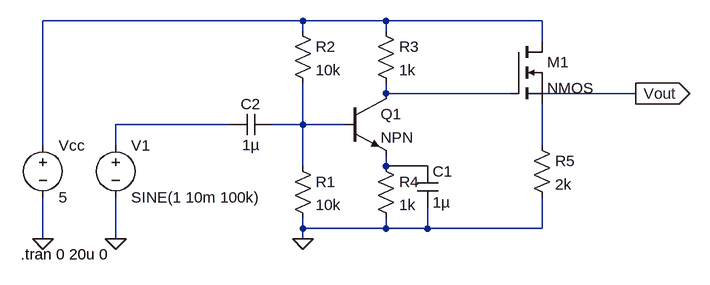
[diagram p0: schematic emissor_comum_bjt_coletor_comum_mos.asc]
emissor_comum_bjt_coletor_comum_mos.asc, the LTspice schematic file:
Version 4
SHEET 1 880 680
WIRE 96 -64 -304 -64
WIRE 224 -64 96 -64
WIRE 464 -64 224 -64
WIRE 96 -48 96 -64
WIRE 224 -48 224 -64
WIRE 464 -32 464 -64
WIRE 224 48 224 32
WIRE 416 48 224 48
WIRE 608 48 464 48
WIRE -16 96 -192 96
WIRE 96 96 96 32
WIRE 96 96 48 96
WIRE 160 96 96 96
WIRE -304 128 -304 -64
WIRE -192 128 -192 96
WIRE 464 128 464 64
WIRE 96 160 96 96
WIRE 224 160 224 144
WIRE 288 160 224 160
WIRE 96 256 96 240
WIRE 224 256 224 240
WIRE 224 256 96 256
WIRE 288 256 288 224
WIRE 288 256 224 256
WIRE 464 256 464 208
WIRE 464 256 288 256
WIRE -304 272 -304 208
WIRE -192 272 -192 208
WIRE 96 272 96 256
FLAG -304 272 0
FLAG -192 272 0
FLAG 96 272 0
FLAG 608 48 Vout
IOPIN 608 48 Out
SYMBOL npn 160 48 R0
SYMATTR InstName Q1
SYMBOL res 80 144 R0
SYMATTR InstName R1
SYMATTR Value 10k
SYMBOL res 80 -64 R0
SYMATTR InstName R2
SYMATTR Value 10k
SYMBOL res 208 -64 R0
SYMATTR InstName R3
SYMATTR Value 1k
SYMBOL res 208 144 R0
SYMATTR InstName R4
SYMATTR Value 1k
SYMBOL cap 272 160 R0
SYMATTR InstName C1
SYMATTR Value 1µ
SYMBOL nmos 416 -32 R0
SYMATTR InstName M1
SYMBOL res 448 112 R0
SYMATTR InstName R5
SYMATTR Value 2k
SYMBOL cap 48 80 R90
WINDOW 0 0 32 VBottom 2
WINDOW 3 32 32 VTop 2
SYMATTR InstName C2
SYMATTR Value 1µ
SYMBOL voltage -192 112 R0
WINDOW 123 0 0 Left 0
WINDOW 39 0 0 Left 0
SYMATTR InstName V1
SYMATTR Value SINE(1 10m 100k)
SYMBOL voltage -304 112 R0
SYMATTR InstName Vcc
SYMATTR Value 5
TEXT -338 296 Left 2 !.tran 0 20u 0

The netlist it stands for:
* emissor_comum_bjt_coletor_comum_mos.asc
Q1 N002 N004 N006 0 NPN
R1 N004 0 10k
R2 N001 N004 10k
R3 N001 N002 1k
R4 N006 0 1k
C1 N006 0 1µ
M1 N001 N002 N005 N005 NMOS
R5 N005 0 2k
C2 N004 N003 1µ
V1 N003 0 SINE(1 10m 100k)
Vcc N001 0 5
.model NPN NPN
.model PNP PNP
.lib standard.bjt
.model NMOS NMOS
.model PMOS PMOS
.lib standard.mos
.tran 0 20u 0
.backanno
.end